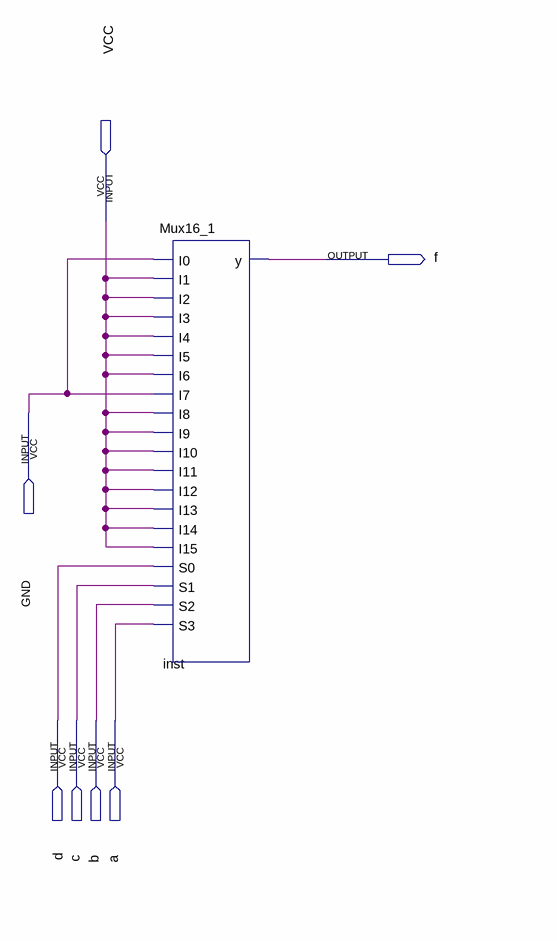
[diagram p0: schematic sheet]
// Quartus schematic MuxDemo3.bdf as structural Verilog: 1 symbols, 7 pins
module MuxDemo3 (
  input  VCC,
  input  GND,
  input  d,
  input  c,
  input  b,
  input  a,
  output f
);

  Mux16_1 inst (
    .I0(GND), .I1(VCC), .I2(VCC), .I3(VCC), .I4(VCC), .I5(VCC), .I6(VCC), .I7(GND), .I8(VCC), .I9(VCC),
    .I10(VCC), .I11(VCC), .I12(VCC), .I13(VCC), .I14(VCC), .I15(VCC), .S0(d), .S1(c), .S2(b), .S3(a), .y(f));
endmodule
